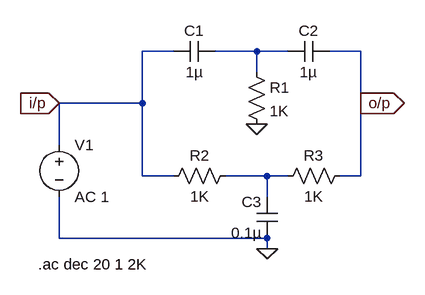
[diagram p0: schematic 6.Band Stop FIlter.asc]
6.Band Stop FIlter.asc, the LTspice schematic file:
Version 4
SHEET 1 880 680
WIRE 192 80 144 80
WIRE 320 80 256 80
WIRE 368 80 320 80
WIRE 480 80 432 80
WIRE 320 112 320 80
WIRE 144 160 144 80
WIRE 144 160 16 160
WIRE 480 160 480 80
WIRE 16 224 16 160
WIRE 144 272 144 160
WIRE 192 272 144 272
WIRE 336 272 272 272
WIRE 368 272 336 272
WIRE 480 272 480 160
WIRE 480 272 448 272
WIRE 336 304 336 272
WIRE 16 368 16 304
WIRE 336 368 16 368
WIRE 336 384 336 368
FLAG 320 192 0
FLAG 336 384 0
FLAG 16 160 i/p
IOPIN 16 160 In
FLAG 480 160 o/p
IOPIN 480 160 Out
SYMBOL cap 256 64 R90
WINDOW 0 0 32 VBottom 2
WINDOW 3 32 32 VTop 2
SYMATTR InstName C1
SYMATTR Value 1µ
SYMBOL cap 432 64 R90
WINDOW 0 0 32 VBottom 2
WINDOW 3 32 32 VTop 2
SYMATTR InstName C2
SYMATTR Value 1µ
SYMBOL cap 352 368 R180
WINDOW 0 24 56 Left 2
WINDOW 3 24 8 Left 2
SYMATTR InstName C3
SYMATTR Value 0.1µ
SYMBOL res 304 96 R0
SYMATTR InstName R1
SYMATTR Value 1K
SYMBOL res 288 256 R90
WINDOW 0 0 56 VBottom 2
WINDOW 3 32 56 VTop 2
SYMATTR InstName R2
SYMATTR Value 1K
SYMBOL res 464 256 R90
WINDOW 0 0 56 VBottom 2
WINDOW 3 32 56 VTop 2
SYMATTR InstName R3
SYMATTR Value 1K
SYMBOL voltage 16 208 R0
WINDOW 123 0 0 Left 0
WINDOW 39 0 0 Left 0
SYMATTR InstName V1
SYMATTR Value AC 1
TEXT -16 408 Left 2 !.ac dec 20 1 2K

The netlist it stands for:
* 6.Band Stop FIlter.asc
C1 N001 i/p 1µ
C2 o/p N001 1µ
C3 0 N002 0.1µ
R1 N001 0 1K
R2 N002 i/p 1K
R3 o/p N002 1K
V1 i/p 0 AC 1
.ac dec 20 1 2K
.backanno
.end